# Altium schematic sheet Display.SchDoc
size A4; PageSetup: Record=PageOptions|CenterHorizontal=True|CenterVertical=True|PrintScale=0.97|XCorrection=1.00|YCorrection=1.00|PrintKind=0|BorderSize=5000000|LeftOffset=0|BottomOffset=0|Orientation=2|PaperLength=1000|PaperWidth=1000|Scale=100|PaperSource=7|PrintQuality=-4|MediaType=1|DitherType=10|PaperKind=A4|PrintScaleMode=1
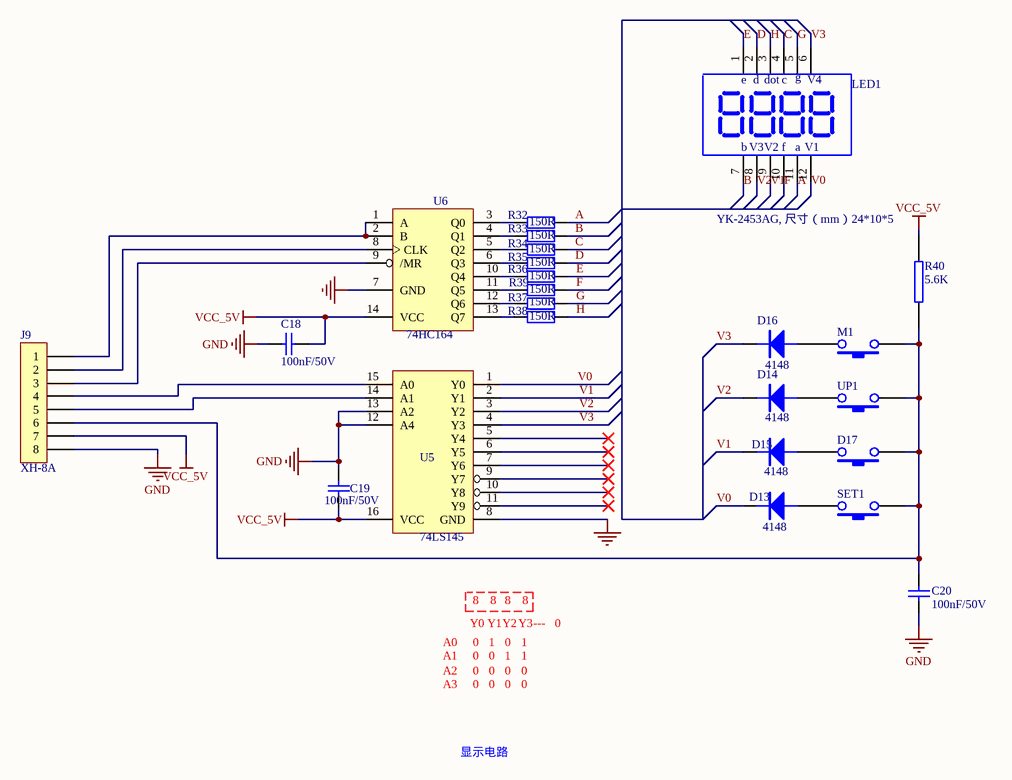
[diagram p0: Display.SchDoc]

## Parts
C18  100nF/50V  [0603C]
C19  100nF/50V  [0603C]
C20  100nF/50V  [0603C]
D13  4148  [LL-34]
D14  4148  [LL-34]
D15  4148  [LL-34]
D16  4148  [LL-34]
D17  (no value)  [SW6545]
J9  XH-8A  [PH2.0MM-8PIN]
LED1  YK-2453AG, 尺寸（mm）24*10*5  [DigitalTube_4W]
M1  (no value)  [SW6545]
R32  150R  [0805R]
R33  150R  [0805R]
R34  150R  [0805R]
R35  150R  [0805R]
R36  150R  [0805R]
R37  150R  [0805R]
R38  150R  [0805R]
R39  150R  [0805R]
R40  5.6K  [0603R]
SET1  (no value)  [SW6545]
U5  74LS145  [SO-16]
U6  74HC164  [SO-14]
UP1  (no value)  [SW6545]

## Nets
GND: C18.2 C19.2 C20.1 J9.8 U5.8(GND) U5.12(A4) U5.13(A2) U6.7(GND)
VCC_5V: C18.1 C19.1 J9.7 R40.2 U5.16(VCC) U6.14(VCC)
A: LED1.11 R32.2
B: LED1.7(B) R33.2
C: LED1.4 R34.2
D: LED1.2 R35.2
E: LED1.1 R36.2
F: LED1.10 R39.2
G: LED1.5 R37.2
H: LED1.3 R38.2
V0: D13.2(K) LED1.12 U5.1(Y0)
V1: D15.2(K) LED1.9 U5.2(Y1)
V2: D14.2(K) LED1.8 U5.3(Y2)
V3: D16.2(K) LED1.6 U5.4(Y3)
NetC20_2: C20.2 D17.1 J9.6 M1.1 R40.1 SET1.1 UP1.1
NetD13_1: D13.1(A) SET1.2
NetD14_1: D14.1(A) UP1.2
NetD15_1: D15.1(A) D17.2
NetD16_1: D16.1(A) M1.2
NetJ9_1: J9.1 U6.1(A) U6.2(B)
NetJ9_2: J9.2 U6.8(CLK)
NetJ9_3: J9.3 U6.9(/MR)
NetJ9_4: J9.4 U5.15(A0)
NetJ9_5: J9.5 U5.14(A1)
NetR32_1: R32.1 U6.3(Q0)
NetR33_1: R33.1 U6.4(Q1)
NetR34_1: R34.1 U6.5(Q2)
NetR35_1: R35.1 U6.6(Q3)
NetR36_1: R36.1 U6.10(Q4)
NetR37_1: R37.1 U6.12(Q6)
NetR38_1: R38.1 U6.13(Q7)
NetR39_1: R39.1 U6.11(Q5)

Not connected (* = marked no-connect by the designer): U5 5(Y4)* 6(Y5)* 7(Y6)* 9(Y7)* 10(Y8)* 11(Y9)*

## Notes on the sheet
- 8
- A2
- A1
- A0
- Y0
- 0
- Y1
- 1
- Y2
- Y3
- ---
- A3
- 显示电路
- Shen Zhen Strong Technology Co,.LTD
- 深圳市思榕科技有限公司
- Title:
- PN:
- APPD（核准）:
- Date:
- CHK（审核）:
- DR（绘图）:
- Rev:
- Sheet:
- of
- (in symbol 数码管，红色，共阴，尺寸（mm）24*10*5) e; d; dot; c; g; V4; b; V3; V2; f; a; V1

## Library data of the parts
C18-C20 = C100nF/50V-0603: 瓷片电容,100nF,5%,X7R,50V,0603; 料号: 10201-10032-00; 品名: 瓷片电容
D13-D16 = DIODE
D17 M1 SET1 UP1 = SW-PB
J9 = CONN-XH-8A: CONN,XH-8A,8PIN,2.54mm插座; 料号: 10701-00016-00; 品名: 线对板连接器
LED1 = 数码管，红色，共阴，尺寸（mm）24*10*5: 品名: YK-2453AG, 尺寸（mm）24*10*5
R32-R39 = R150R-0805: 金属膜电阻,150R,1%,1/8W,0805; 料号: 10101-15003-00; 品名: 金属膜电阻
R40 = RES2
U5 = 74LS595
U6 = 74LS164